# Altium schematic sheet lixietube_schematic.SchDoc
size A4; SheetNumber: 1; SheetTotal: 1
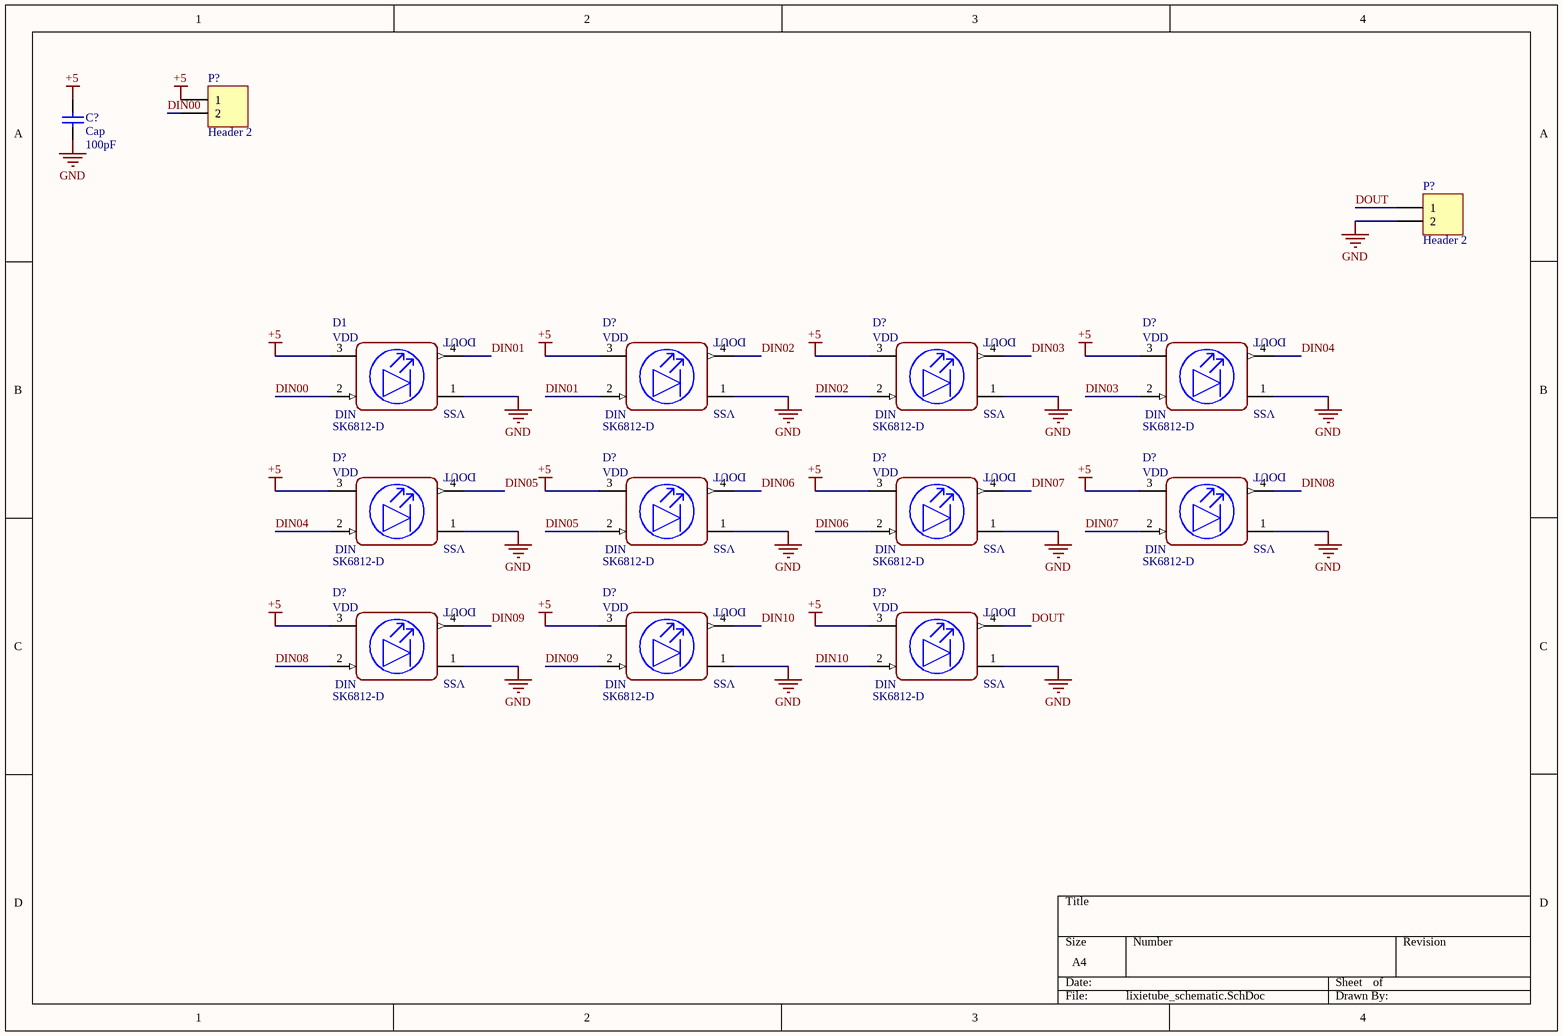
[diagram p0: lixietube_schematic.SchDoc]

## Parts
(Parts that share a designator on the sheet are numbered #1, #2 ... from top to bottom, then left to right.)
C?  Cap  value 100pF  [RAD-0.3]
D1  Part Number: SK6812-D  [Adafruit_SK6812-D_0]  (hidden comment: Diode_Adafruit_SK6812-D_eec)
D?#1  Part Number: SK6812-D  [Adafruit_SK6812-D_0]  (hidden comment: Diode_Adafruit_SK6812-D_eec)
D?#2  Part Number: SK6812-D  [Adafruit_SK6812-D_0]
D?#3  Part Number: SK6812-D  [Adafruit_SK6812-D_0]  (hidden comment: Diode_Adafruit_SK6812-D_eec)
D?#4  Part Number: SK6812-D  [Adafruit_SK6812-D_0]  (hidden comment: Diode_Adafruit_SK6812-D_eec)
D?#5  Part Number: SK6812-D  [Adafruit_SK6812-D_0]  (hidden comment: Diode_Adafruit_SK6812-D_eec)
D?#6  Part Number: SK6812-D  [Adafruit_SK6812-D_0]  (hidden comment: Diode_Adafruit_SK6812-D_eec)
D?#7  Part Number: SK6812-D  [Adafruit_SK6812-D_0]  (hidden comment: Diode_Adafruit_SK6812-D_eec)
D?#8  Part Number: SK6812-D  [Adafruit_SK6812-D_0]  (hidden comment: Diode_Adafruit_SK6812-D_eec)
D?#9  Part Number: SK6812-D  [Adafruit_SK6812-D_0]  (hidden comment: Diode_Adafruit_SK6812-D_eec)
D?#10  Part Number: SK6812-D  [Adafruit_SK6812-D_0]  (hidden comment: Diode_Adafruit_SK6812-D_eec)
P?#1  Header 2  [HDR1X2]
P?#2  Header 2  [HDR1X2]

## Nets
+5: C?.2 D1.3(VDD) D?#1.3(VDD) D?#2.3(VDD) D?#3.3(VDD) D?#4.3(VDD) D?#5.3(VDD) D?#6.3(VDD) D?#7.3(VDD) D?#8.3(VDD) D?#9.3(VDD) D?#10.3(VDD) P?#1.1
GND: C?.1 D1.1(VSS) D?#1.1(VSS) D?#2.1(VSS) D?#3.1(VSS) D?#4.1(VSS) D?#5.1(VSS) D?#6.1(VSS) D?#7.1(VSS) D?#8.1(VSS) D?#9.1(VSS) D?#10.1(VSS) P?#2.2
DIN00: D1.2(DIN) P?#1.2
DIN01: D1.4(DOUT) D?#1.2(DIN)
DIN02: D?#1.4(DOUT) D?#2.2(DIN)
DIN03: D?#2.4(DOUT) D?#3.2(DIN)
DIN04: D?#3.4(DOUT) D?#4.2(DIN)
DIN05: D?#4.4(DOUT) D?#5.2(DIN)
DIN06: D?#5.4(DOUT) D?#6.2(DIN)
DIN07: D?#6.4(DOUT) D?#7.2(DIN)
DIN08: D?#7.4(DOUT) D?#8.2(DIN)
DIN09: D?#8.4(DOUT) D?#9.2(DIN)
DIN10: D?#9.4(DOUT) D?#10.2(DIN)
DOUT: D?#10.4(DOUT) P?#2.1

## Library data of the parts
C? = Cap: Capacitor; Published: 8-Jun-2000; LatestRevisionDate: 17-Jul-2002; LatestRevisionNote: Re-released for DXP Platform.; PackageReference: RAD-0.3; Publisher: Altium Limited; PackageDescription: Radial Cap, Thru-Hole; 2 Leads; 0.3 in Pin Spacing
D?#2 = Diode_Adafruit_SK6812-D_eec: helpURL: https://upverter.com/upn/revision/c89e73b2d25df682/; ComponentLink2Description: Datasheet; Temperature: -40°C to +85°C; Package: SMT_LED_5MM0; Supplier 2: Mouser; Supplier 1: Digi-Key; ComponentLink1URL: https://upverter.com/upn/revision/c89e73b2d25df682/; Manufacturer: Adafruit; ComponentLink1Description: Upverter; ComponentLink2URL: https://cdn-shop.adafruit.com/product-files/1138/SK6812+LED+datasheet+.pdf; RoHS: TRUE; Temperature Range High: +85°C; Temperature Range Low: -40°C; Lead Free: yes; Ipc Land Pattern Name: SOIC320P540X160-4
P?#1 P?#2 = Header 2: Header, 2-Pin; LatestRevisionDate: 17-Jul-2002; LatestRevisionNote: Re-released for DXP Platform.; Publisher: Altium Limited
D1 D?#1 D?#3-D?#10 = Diode_Adafruit_SK6812-D_eec: helpURL: https://upverter.com/upn/revision/c89e73b2d25df682/; ComponentLink2Description: Datasheet; Temperature: -40°C to +85°C; Package: SMT_LED_5MM0; Supplier 2: Mouser; Supplier 1: Digi-Key; ComponentLink1URL: https://upverter.com/upn/revision/c89e73b2d25df682/; Manufacturer: Adafruit; ComponentLink1Description: Upverter; ComponentLink2URL: https://cdn-shop.adafruit.com/product-files/1138/SK6812+LED+datasheet+.pdf; RoHS: TRUE; Temperature Range High: +85°C; Temperature Range Low: -40°C; Lead Free: yes; Ipc Land Pattern Name: SOIC320P540X160-4